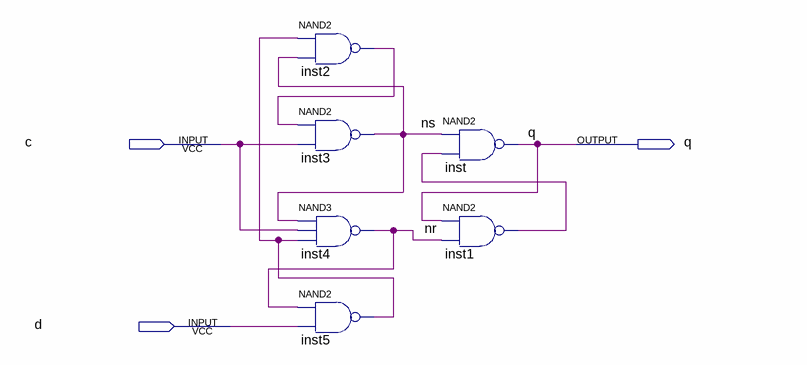
[diagram p0: schematic sheet]
// Quartus schematic s54_d3tr.bdf as structural Verilog: 6 symbols, 3 pins
module s54_d3tr (
  input  c,
  input  d,
  output q
);

  wire inst1_out, inst2_out, inst5_out, nr, ns;

  nand inst2 (inst2_out, inst5_out, ns);
  nand inst3 (ns, inst2_out, c);
  nand inst4 (nr, ns, c, inst5_out);
  nand inst5 (inst5_out, nr, d);
  nand inst (q, ns, inst1_out);
  nand inst1 (inst1_out, q, nr);
endmodule
